# EAGLE design m1-instruction-register (EAGLE 9.6.1)
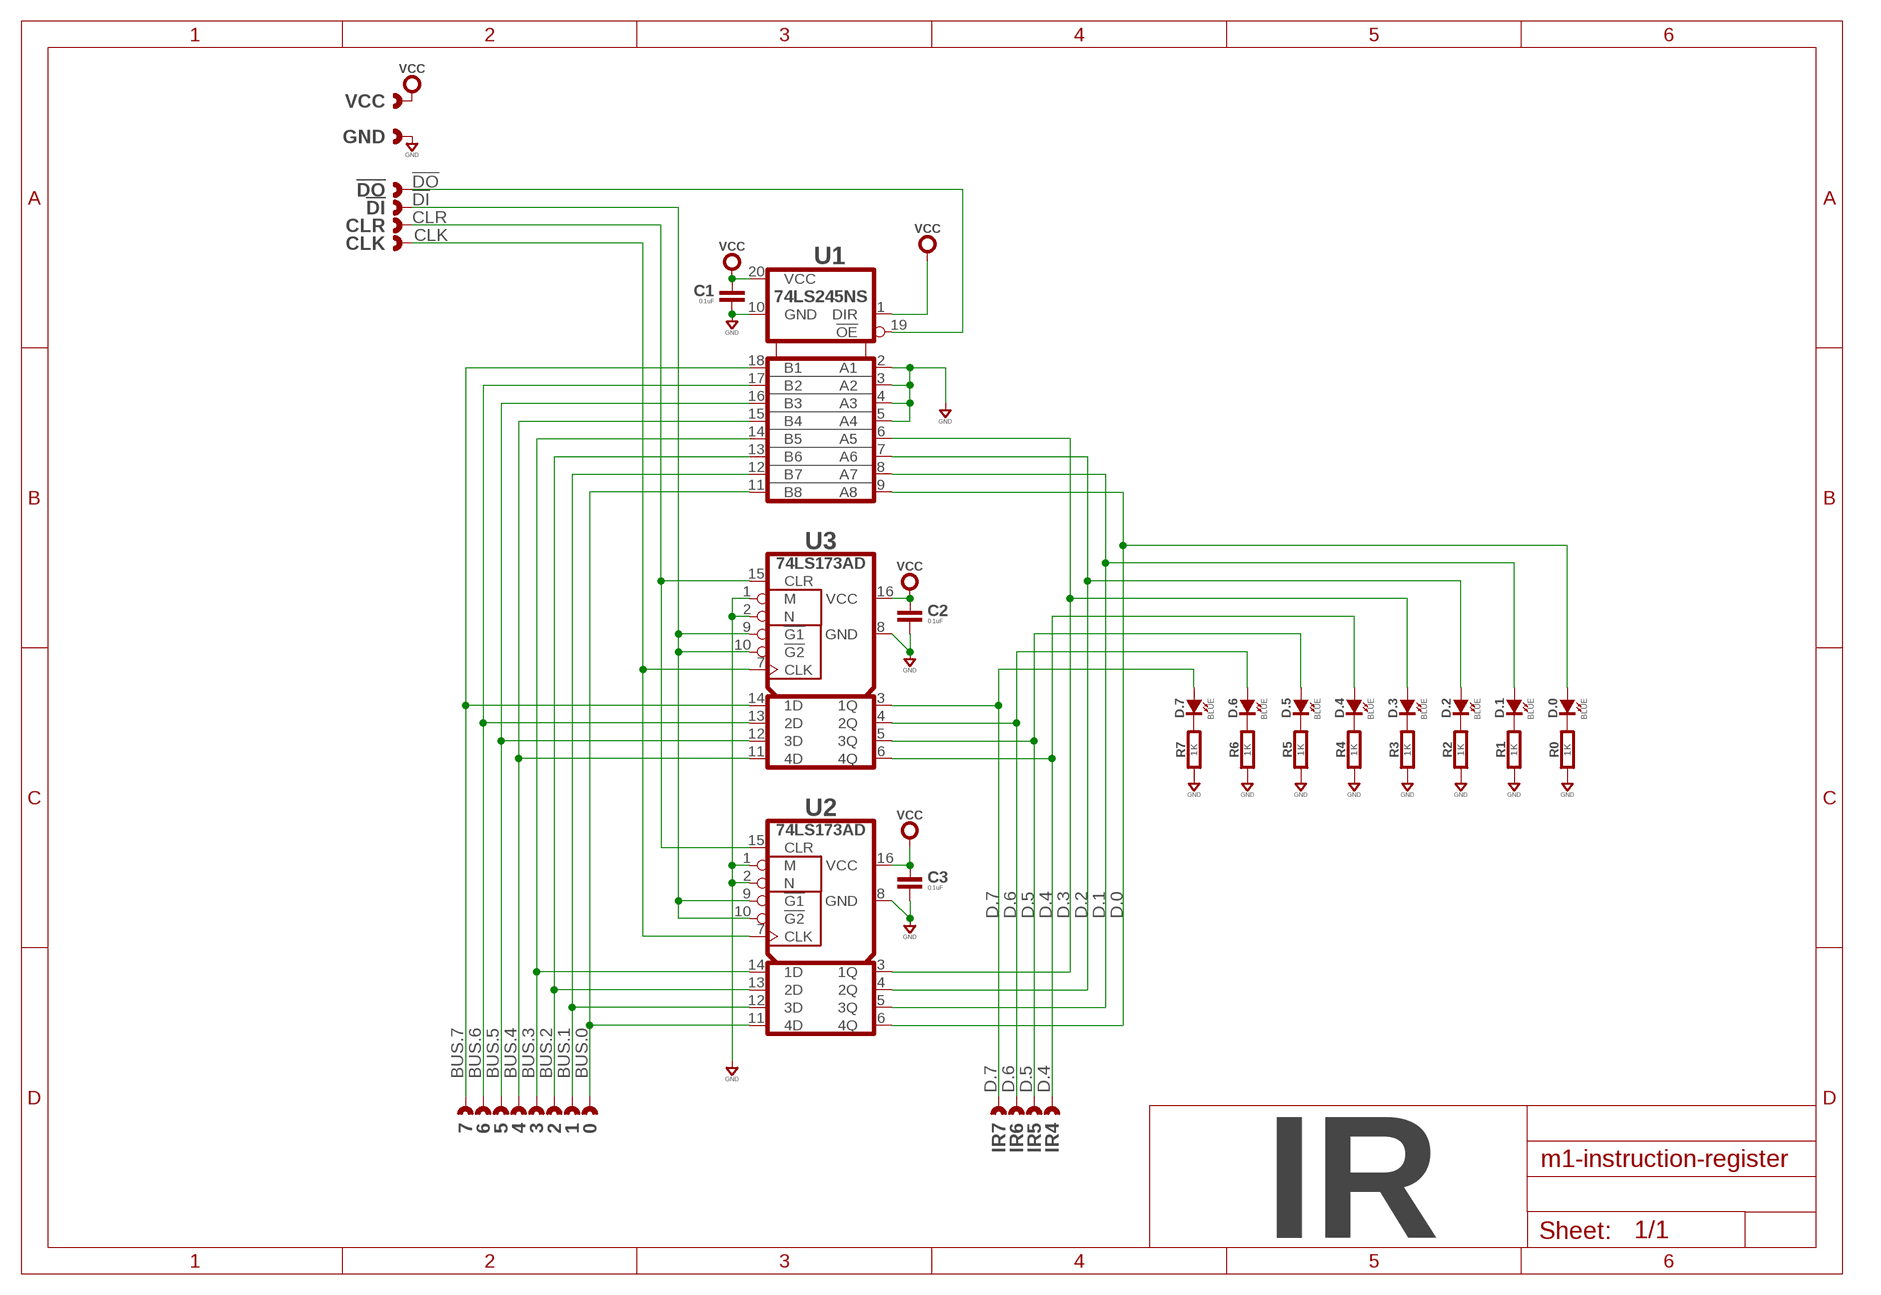
[diagram p0: schematic, sheet 1]

## Parts
0  CAST-01X1  [CAST01-2.54MM]
1  CAST-01X1  [CAST01-2.54MM]
2  CAST-01X1  [CAST01-2.54MM]
3  CAST-01X1  [CAST01-2.54MM]
4  CAST-01X1  [CAST01-2.54MM]
5  CAST-01X1  [CAST01-2.54MM]
6  CAST-01X1  [CAST01-2.54MM]
7  CAST-01X1  [CAST01-2.54MM]
!DI  CAST-01X1  [CAST01-2.54MM]
!DO  CAST-01X1  [CAST01-2.54MM]
C1  0.1uF  CAPACITOR0603  [0603-CAP]
C2  0.1uF  CAPACITOR0603  [0603-CAP]
C3  0.1uF  CAPACITOR0603  [0603-CAP]
CLK  CAST-01X1  [CAST01-2.54MM]
CLR  CAST-01X1  [CAST01-2.54MM]
D.0  BLUE  SMT0603  [SMD_0603]
D.1  BLUE  SMT0603  [SMD_0603]
D.2  BLUE  SMT0603  [SMD_0603]
D.3  BLUE  SMT0603  [SMD_0603]
D.4  BLUE  SMT0603  [SMD_0603]
D.5  BLUE  SMT0603  [SMD_0603]
D.6  BLUE  SMT0603  [SMD_0603]
D.7  BLUE  SMT0603  [SMD_0603]
GND  CAST-01X1  [CAST01-2.54MM]
IR4  CAST-01X1  [CAST01-2.54MM]
IR5  CAST-01X1  [CAST01-2.54MM]
IR6  CAST-01X1  [CAST01-2.54MM]
IR7  CAST-01X1  [CAST01-2.54MM]
R0  1K  RESISTOR0603  [0603-RES]
R1  1K  RESISTOR0603  [0603-RES]
R2  1K  RESISTOR0603  [0603-RES]
R3  1K  RESISTOR0603  [0603-RES]
R4  1K  RESISTOR0603  [0603-RES]
R5  1K  RESISTOR0603  [0603-RES]
R6  1K  RESISTOR0603  [0603-RES]
R7  1K  RESISTOR0603  [0603-RES]
U1  74LS245NS  [SO20]
U2  74LS173AD  [SO16]
U3  74LS173AD  [SO16]
VCC  CAST-01X1  [CAST01-2.54MM]

## Nets
!DI: !DI.1 U2.9(!G1) U2.10(!G2) U3.9(!G1) U3.10(!G2)
!DO: !DO.1 U1.19(!OE)
BUS.0: 0.1 U1.11(B8) U2.11(4D)
BUS.1: 1.1 U1.12(B7) U2.12(3D)
BUS.2: 2.1 U1.13(B6) U2.13(2D)
BUS.3: 3.1 U1.14(B5) U2.14(1D)
BUS.4: 4.1 U1.15(B4) U3.11(4D)
BUS.5: 5.1 U1.16(B3) U3.12(3D)
BUS.6: 6.1 U1.17(B2) U3.13(2D)
BUS.7: 7.1 U1.18(B1) U3.14(1D)
CLK: CLK.1 U2.7(CLK) U3.7(CLK)
CLR: CLR.1 U2.15(CLR) U3.15(CLR)
D.0: D.0.A U1.9(A8) U2.6(4Q)
D.1: D.1.A U1.8(A7) U2.5(3Q)
D.2: D.2.A U1.7(A6) U2.4(2Q)
D.3: D.3.A U1.6(A5) U2.3(1Q)
D.4: D.4.A IR4.1 U3.6(4Q)
D.5: D.5.A IR5.1 U3.5(3Q)
D.6: D.6.A IR6.1 U3.4(2Q)
D.7: D.7.A IR7.1 U3.3(1Q)
GND: C1.2 C2.2 C3.2 GND.1 R0.1 R1.1 R2.1 R3.1 R4.1 R5.1 R6.1 R7.1 U1.2(A1) U1.3(A2) U1.4(A3) U1.5(A4) U1.10(GND) U2.1(M) U2.2(N) U2.8(GND) U3.1(M) U3.2(N) U3.8(GND)
N$1: D.0.K(C) R0.2
N$2: D.1.K(C) R1.2
N$3: D.2.K(C) R2.2
N$4: D.3.K(C) R3.2
N$5: D.4.K(C) R4.2
N$6: D.5.K(C) R5.2
N$7: D.6.K(C) R6.2
N$8: D.7.K(C) R7.2
VCC: C1.1 C2.1 C3.1 U1.1(DIR) U1.20(VCC) U2.16(VCC) U3.16(VCC) VCC.1

## Notes on the sheet
- IR

## Library data of the parts
0 1-7 !DI !DO CLK CLR GND IR4-IR7 VCC = con-headers:CAST-01X1: Castelated Edge Hole Pad
C1-C3 = rlc:CAPACITOR: Capacitor CAP
D.0 D.1-D.7 = led:SMT: LED SMT
R0 R1-R7 = rlc:RESISTOR: Resistor
U1 = logic:74*245?: 74245 Octal Transceiver
U2 U3 = logic:74*173A?: 74*173 Logic

## Board
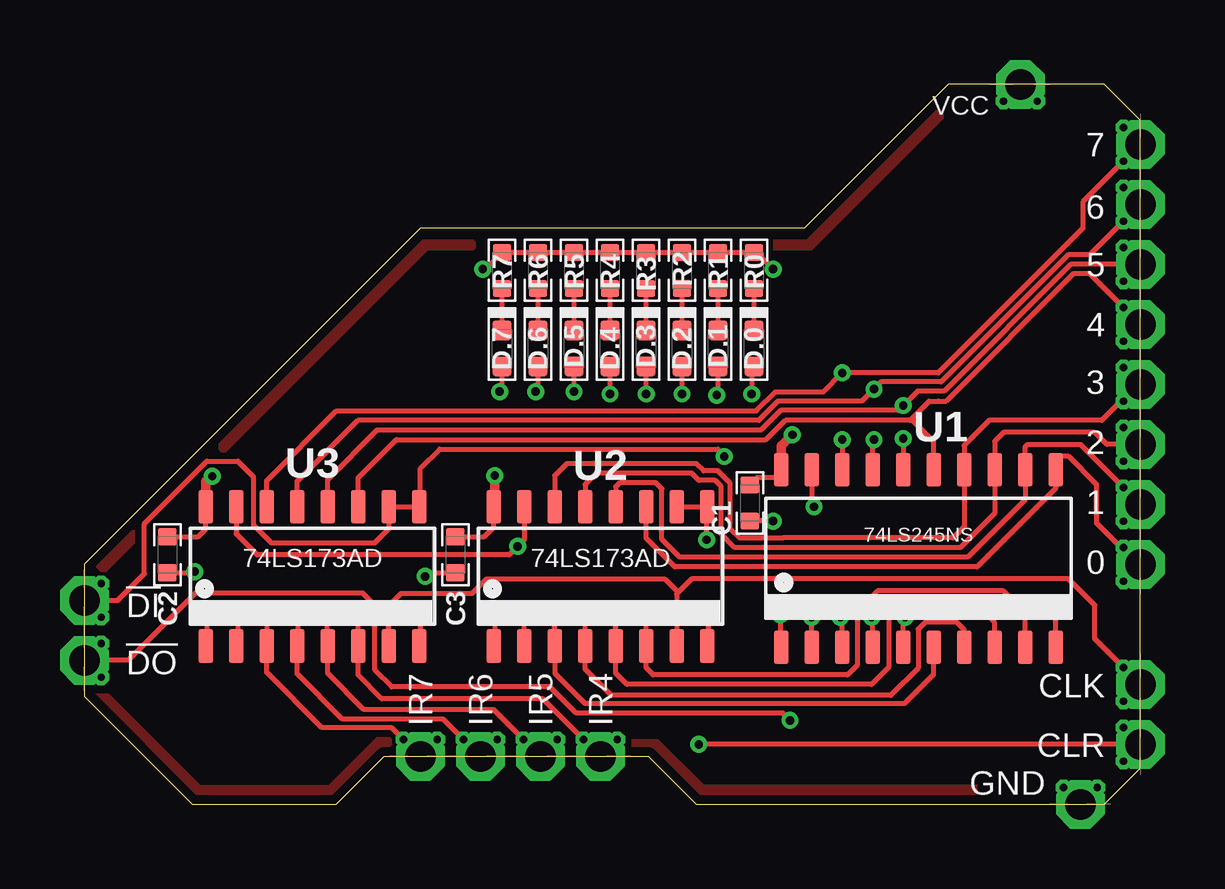
[diagram p1: board, top side]
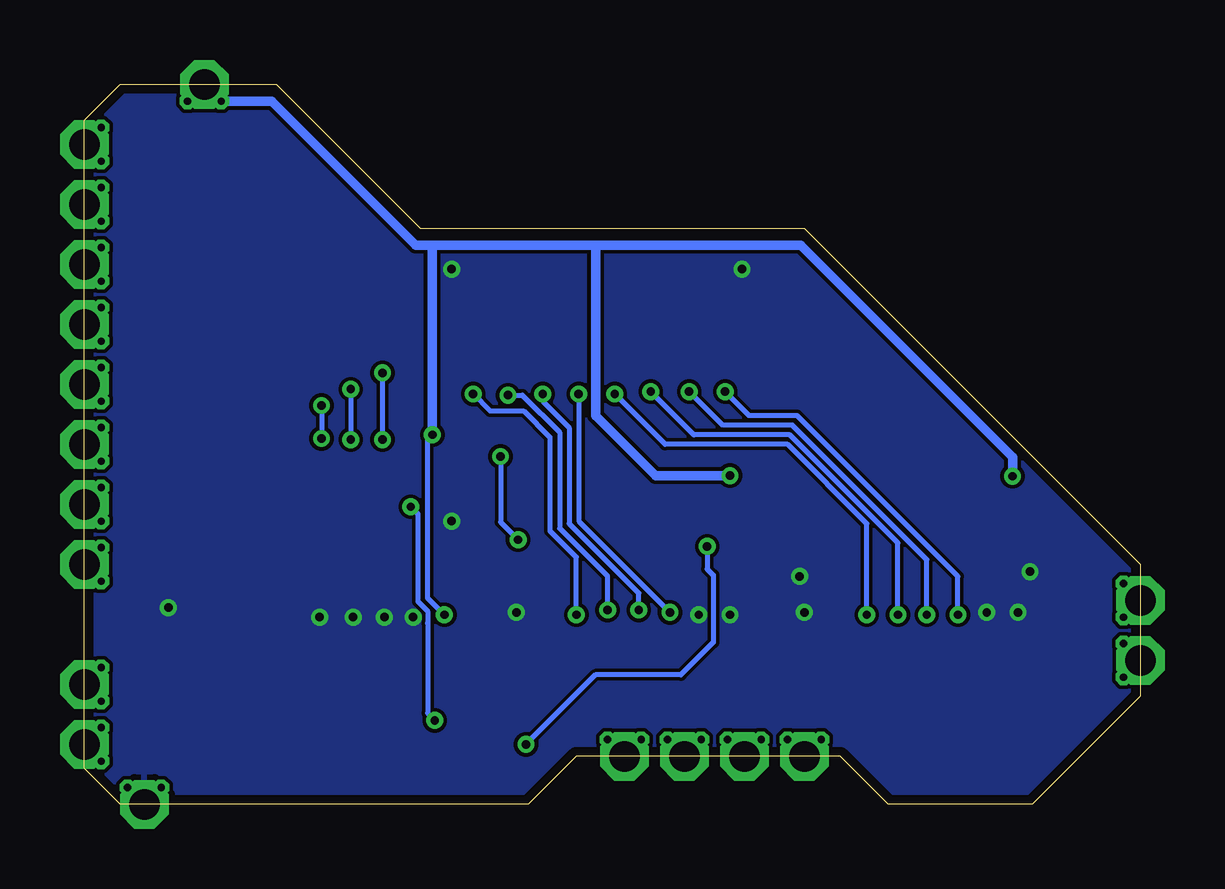
[diagram p2: board, bottom side, seen from below]

Size 44 x 30 mm. Coordinates in mm from the lower left corner, seen from the top.
Outline: 4.5,0 10.5,0 12.5,2 23.5,2 25.5,0 42.5,0 44,1.5 44,28.5 42.5,30 36,30 30,24 14,24 0,10 0,4.5 4.5,0
Copper layers (1*16): Top 0.0356mm / dielectric 1.5011mm / Bottom 0.0356mm
Design rules "OSH-CircuitMonkey *": minimum track width 6mil, minimum drill 12mil, track to track 6mil, track to pad 6mil, pad to pad 6mil, via to via 6mil, smd to smd 6mil, copper to edge 15mil, drill to drill 6mil, minimum pad ring 7mil, minimum via ring 7mil, stop-mask expansion 3mil, vias tented up to drill 14mil, thermal gap 10mil

### Footprints (pad centres in the part's own frame; a part is rotated, then mirrored left to right if it is on the bottom)
CAST01-2.54MM = drill 1.27 pad 2.032 octagon: 1 0,0 | drill 0.305 octagon: P$1 -0.7,0.7; P$2 -0.7,-0.7
0603-CAP = smd 0.711 x 0.762: 1 -0.752,0; 2 0.752,0
SMD_0603 = smd 0.8 x 0.8: A 0.75,0; K -0.75,0
0603-RES = smd 0.711 x 0.762: 1 -0.752,0; 2 0.752,0
SO20 = smd 0.6 x 1.4: 1 -5.715,-3.7; 2 -4.445,-3.7; 3 -3.175,-3.7; 4 -1.905,-3.7; 5 -0.635,-3.7; 6 0.635,-3.7; 7 1.905,-3.7; 8 3.175,-3.7; 9 4.445,-3.7; 10 5.715,-3.7; 11 5.715,3.7; 12 4.445,3.7; 13 3.175,3.7; 14 1.905,3.7; 15 0.635,3.7; 16 -0.635,3.7; 17 -1.905,3.7; 18 -3.175,3.7; 19 -4.445,3.7; 20 -5.715,3.7
SO16 = smd 0.6 x 1.4: 1 -4.445,-2.9; 2 -3.175,-2.9; 3 -1.905,-2.9; 4 -0.635,-2.9; 5 0.635,-2.9; 6 1.905,-2.9; 7 3.175,-2.9; 8 4.445,-2.9; 9 4.445,2.9; 10 3.175,2.9; 11 1.905,2.9; 12 0.635,2.9; 13 -0.635,2.9; 14 -1.905,2.9; 15 -3.175,2.9; 16 -4.445,2.9

### Placement (x,y rotation side)
0  44,10 0 top
1  44,12.5 0 top
2  44,15 0 top
3  44,17.5 0 top
4  44,20 0 top
5  44,22.5 0 top
6  44,25 0 top
7  44,27.5 0 top
!DI  0,8.5 180 top
!DO  0,6 180 top
C1  27.73,12.56 270 top
C2  3.46,10.4 270 top
C3  15.46,10.4 270 top
CLK  44,5 0 top
CLR  44,2.5 0 top
D.0  27.9,19 270 top
D.1  26.4,19 270 top
D.2  24.9,19 270 top
D.3  23.4,19 270 top
D.4  21.9,19 270 top
D.5  20.4,19 270 top
D.6  18.9,19 270 top
D.7  17.4,19 270 top
GND  41.5,0 270 top
IR4  21.5,2 270 top
IR5  19,2 270 top
IR6  16.5,2 270 top
IR7  14,2 270 top
R0  27.9,22.25 270 top
R1  26.4,22.25 270 top
R2  24.9,22.25 270 top
R3  23.4,22.25 270 top
R4  21.9,22.25 270 top
R5  20.4,22.25 270 top
R6  18.9,22.25 270 top
R7  17.4,22.25 270 top
U1  34.75,10.25 0 top
U2  21.5,9.5 0 top
U3  9.5,9.5 0 top
VCC  39,30 90 top

### Tracks (layer width: path | path; a pad name or v marks a point on that pad's centre or on a via)
!DI  (via drill 0.35)
  Top 0.2: !DI.1 1.4,8.5 2.5,9.6 2.5,11.7 5.1,14.3 6.4,14.3 7.04,13.66 7.04,11.65 7.79,10.9 12.1,10.9 12.7,11.5 12.7,12.38 U3.10 U3.9 14,12.46 14,14 14.8,14.8 26.4,14.8 26.66,14.54 v26.66,14.49 | v25.93,11.03 25.93,12.38 U2.9 U2.10
  Bottom 0.2: v26.66,14.49 26.66,11.76 v25.93,11.03
!DO  (via drill 0.35)
  Top 0.2: v29.4,3.5 29.1,3.8 20.5,3.8 19.4,4.9 12.8,4.9 12.11,5.59 12.11,8.29 11.6,8.8 4.62,8.8 1.84,6.02 0.02,6.02 !DO.1 | U1.19 30.3,13.94 30.3,12.5 v30.4,12.4
  Bottom 0.2: v30.4,12.4 30.1,12.1 30.1,8.46 29.7,8.05 29.7,7.55 29.7,7.54 29.7,3.8 v29.4,3.5
AAA
  pour Top: 0.4,4.6 1,4.6 4.8,0.8 10.2,0.8 12.2,2.8 12.7,2.8 12.8,2.7 12.8,2.5 12.7,2.4 12.4,2.4 10.4,0.4 4.6,0.4
BBB
  pour Top: 37.2,0.4 37.2,0.8 25.8,0.8 23.9,2.7 22.8,2.7 22.8,2.4 23.6,2.4 25.6,0.4
BUS.0
  Top 0.152: 0.1 43.9,10
  Top 0.2: 43.9,10 42.17,11.73 42.17,13.35 41.02,14.5 40.5,14.5 40.47,14.47 U1.11 40.47,13.17 37.2,9.9 24.6,9.9 23.41,11.1 U2.11
BUS.1
  Top 0.152: U1.12
  Top 0.2: U1.12 39.2,14.9 39.3,15 41.5,15 1.1 | U1.12 39.2,12.7 36.8,10.3 24.8,10.3 24.06,11.04 24.06,13.15 23.81,13.4 22.3,13.4 22.14,13.23 U2.12
BUS.2
  Top 0.2: 2.1 42.6,15 42.1,15.5 38.3,15.5 37.93,15.13 U1.13 37.93,12.13 36.5,10.7 27.1,10.7 26.53,11.27 26.53,13.25 26.28,13.5 25.6,13.5 25.3,13.8 21.33,13.8 20.86,13.33 U2.13
BUS.3
  Top 0.2: 3.1 43.9,17.5 42.4,16 37.7,16 36.66,14.96 U1.14 36.66,11.56 36.2,11.1 29.1,11.1 29.09,11.09 27.3,11.09 26.9,11.49 26.9,13.4 26.4,13.9 25.8,13.9 25.5,14.2 20.1,14.2 19.59,13.7 U2.14
BUS.4
  Top 0.2: 4.1 41.9,22.1 41.2,22.1 35.91,16.8 35.59,16.8 35.58,16.8 35.2,16.8 34.45,16.05 | 34.45,16.05 34.41,16 29.2,16 28.4,15.2 13,15.2 11.4,13.61 U3.11 | U1.15 35.39,15.11 34.45,16.05
BUS.5  (via drill 0.35)
  Top 0.2: 5.1 41.1,22.5 35.82,17.22 34.72,17.22 v34.12,16.62 33.92,16.42 29.02,16.42 28.2,15.6 12.2,15.6 10.13,13.54 U3.12 | v34.12,15.25 U1.16
  Bottom 0.2: v34.12,16.62 v34.12,15.25
BUS.6  (via drill 0.35)
  Top 0.152: v32.9,15.2 32.85,15.15
  Top 0.2: 6.1 41.9,22.9 41,22.9 35.7,17.6 33.2,17.6 v32.9,17.3 32.4,16.8 28.9,16.8 28.1,16 11.4,16 8.87,13.46 U3.13 | U1.17 32.85,15.15
  Bottom 0.2: v32.9,17.3 v32.9,15.2
BUS.7  (via drill 0.35)
  Top 0.2: v31.58,15.2 U1.18 | 7.1 41.6,25.1 41.6,24 35.58,17.98 v31.58,17.98 30.78,17.18 28.78,17.18 28,16.4 10.5,16.4 7.59,13.49 U3.14
  Bottom 0.2: v31.58,17.98 v31.58,15.2
CCC
  pour Top: 0.5,9.9 0.7,9.7 0.9,9.7 2.1,10.9 2.1,11.4 2,11.4
CLK
  Top 0.2: CLK.1 42.1,6.9 42.1,8.3 41,9.4 25.3,9.4 24.68,8.78 | 24.68,8.78 24.68,8.9 24.18,9.4 16.76,9.4 16.16,8.79 13.2,8.79 12.68,8.28 U3.7 | 24.68,8.78 U2.7
CLR  (via drill 0.35)
  Top 0.2: U3.15 6.33,11.28 7.2,10.4 17.7,10.4 v18.05,10.75 18.32,11.03 U2.15 | CLR.1 v25.6,2.5
  Bottom 0.2: v18.05,10.75 18.05,9.81 17.8,9.55 17.8,6.75 19.15,5.39 22.7,5.39 v25.6,2.5
D.0  (via drill 0.35)
  Top 0.2: U1.9 39.2,7.98 38.28,8.9 33.04,8.9 32.2,8.05 32.2,5.79 31.8,5.4 23.7,5.4 23.41,5.7 U2.6 23.41,7.8 v23.5,7.9 | D.0.A 27.8,18.15 v27.8,17.1
  Bottom 0.2: v23.5,7.9 23.5,10.3 24.6,11.4 24.6,15.3 25.7,16.4 27.1,16.4 v27.8,17.1
D.1  (via drill 0.35)
  Top 0.2: U1.8 37.93,7.58 37.01,8.5 34,8.5 33.51,8.01 33.51,5.71 32.8,5 22.6,5 22.14,5.46 U2.5 22.14,8.04 v22.2,8.1 | D.1.A 26.4,17.1 v26.35,17.05
  Bottom 0.2: v22.2,8.1 22.2,9.5 24.2,11.5 24.2,15.5 25.75,17.05 v26.35,17.05
D.2  (via drill 0.35)
  Top 0.2: U1.7 36.66,7.28 36.34,7.6 35.04,7.6 34.74,7.3 34.74,5.68 33.6,4.55 21.95,4.55 20.86,5.63 U2.4 20.86,8.06 v20.9,8.1 | D.2.A v24.9,17.1
  Bottom 0.2: v20.9,8.1 20.9,8.8 23.8,11.7 23.8,15.7 24.9,16.8 v24.9,17.1
D.3  (via drill 0.35)
  Top 0.2: U1.6 35.37,6.53 35.37,5.39 34.17,4.19 20.87,4.19 19.61,5.45 19.61,6.58 U2.3 v19.59,8 v19.6,8 | D.3.A 23.4,17.3 23.41,17.3 v23.41,17.1
  Bottom 0.2: v19.6,8 23.4,11.8 v23.4,17.09 v23.41,17.1
D.4  (via drill 0.35)
  Top 0.2: IR4.1 19.1,4.4 12.4,4.4 11.4,5.39 U3.6 v11.4,7.9 | D.4.A v21.9,17.1
  Bottom 0.2: v11.4,7.9 11.4,11.7 14.7,15 19.8,15 v21.9,17.1
D.5  (via drill 0.35)
  Top 0.2: IR5.1 17.05,3.95 11.65,3.95 10.13,5.47 U3.5 10.1,6.63 v10.1,7.9 | D.5.A v20.4,17.2
  Bottom 0.2: v10.1,7.9 10.1,10.9 14.6,15.4 18.6,15.4 v20.4,17.2
D.6  (via drill 0.35)
  Top 0.2: IR6.1 14.95,3.55 10.75,3.55 8.87,5.43 U3.4 8.9,6.63 v8.9,7.9 | D.6.A 18.9,17.3 v18.8,17.2
  Bottom 0.2: v8.9,7.9 8.9,10.2 14.5,15.8 17.4,15.8 v18.8,17.2
D.7  (via drill 0.35)
  Top 0.2: IR7.1 12.8,3.2 9.9,3.2 7.59,5.5 U3.3 v7.6,7.9 | D.7.A 17.4,17.3 v17.3,17.2
  Bottom 0.2: v7.6,7.9 7.6,9.5 14.3,16.2 16.3,16.2 v17.3,17.2
EEE
  pour Top: 5.6,15 5.6,14.8 5.7,14.7 5.9,14.7 14.3,23.1 16.2,23.1 16.3,23.2 16.3,23.4 16.2,23.5 14.1,23.5
FFF
  pour Top: 28.7,23.5 28.7,23.1 30.3,23.1 35.8,28.6 35.8,28.9 35.5,28.9 30.1,23.5
GND  (via drill 0.35)
  Top 0.2: U1.2 v30.3,7.8 | U1.3 31.58,7.72 v31.5,7.8 | U1.4 32.85,7.75 v32.8,7.8 | U1.5 34.12,7.72 v34.2,7.8 | v28.7,11.8 v28.69,11.81 C1.2 | v26,8 26,6.66 U2.8 | v17.1,7.9 17.1,6.64 U2.1 | v14,8 14,6.66 U3.8 | v14.2,9.5 14.35,9.65 C3.2 | U2.2 18.32,7.83 v18.4,7.9 | U1.10 40.47,8.17 v40.5,8.2 | v16.6,22.3 16.7,22.3 R7.1 R6.1 R5.1 R4.1 R3.1 R2.1 R1.1 R0.1 28,23 v28.7,22.3 | C2.2 4.55,9.65 v4.6,9.7 | v5.1,8 5.1,6.64 U3.1 | v6.4,8 6.4,6.67 U3.2
  pour Bottom: 4.5,0 0,4.5 0,10 14,24 30,24 36,30 42.5,30 44,28.5 44,1.5 42.5,0 25.5,0 23.5,2 12.5,2 10.5,0
N$1
  Top 0.2: R0.2 D.0.K
N$2
  Top 0.2: R1.2 D.1.K
N$3
  Top 0.2: R2.2 D.2.K
N$4
  Top 0.2: R3.2 D.3.K
N$5
  Top 0.2: R4.2 D.4.K
N$6
  Top 0.2: R5.2 D.5.K
N$7
  Top 0.2: R6.2 D.6.K
N$8
  Top 0.2: R7.2 D.7.K
VCC  (via drill 0.35)
  Top 0.2: U1.20 29.04,13.75 28.91,13.61 28.03,13.61 C1.1 | C3.1 16.65,11.15 17.05,11.55 U2.16 | C2.1 4.75,11.15 5.05,11.46 U3.16 | v29,7.9 29,6.58 U1.1
  Top 0.4: v17.1,13.7 17.1,12.45 U2.16 | U3.16 5.05,13.46 5.27,13.67 v5.33,13.67 | U1.20 29.04,14.94 v29.5,15.4
  Bottom 0.2: v29.5,15.4 29.5,15.36 29.7,15.15 29.7,8.61 v29,7.9
  Bottom 0.4: VCC.1 38.3,29.3 36.2,29.3 30.2,23.3 29.5,23.3 | v17.1,13.7 20.2,13.7 22.7,16.2 22.7,23.3 | v5.33,13.67 5.33,14.47 14.16,23.3 22.7,23.3 | 22.7,23.3 29.5,23.3 | v29.5,15.4 29.5,23.3